# EAGLE schematic Trabalho_Esquematico (EAGLE 9.7.0)
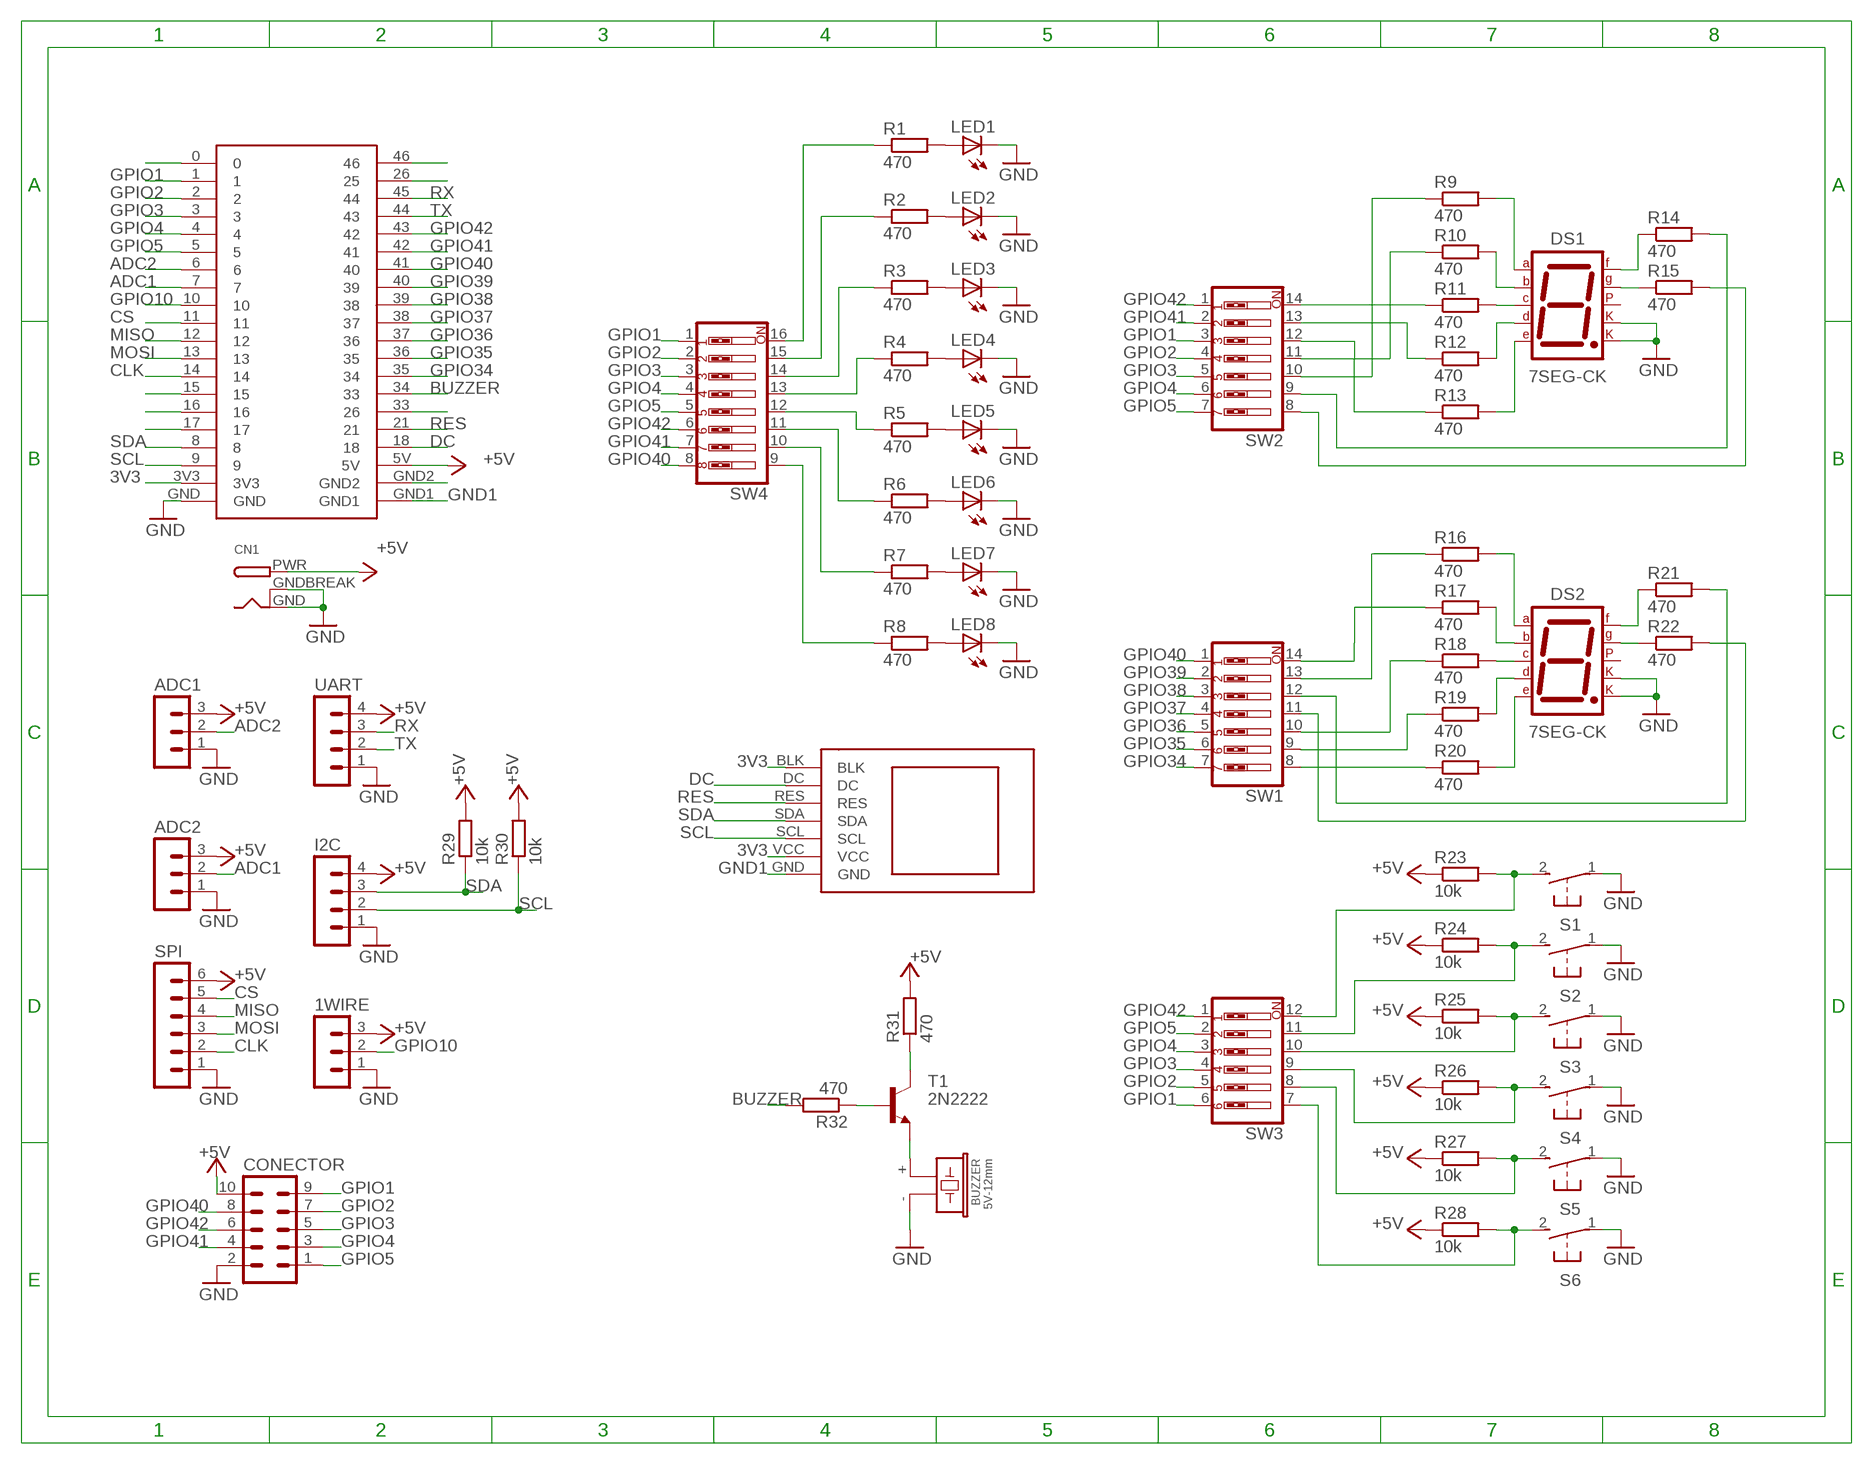
[diagram p0: schematic, sheet 1]

## Parts
1WIRE  MA03-1  [MA03-1]
ADC1  MA03-1  [MA03-1]
ADC2  MA03-1  [MA03-1]
BUZZER  5V-12mm  F/CM12P  [F/CM12P]
CN1  DCBARRELPTH  [DCJACK_2MM_PTH]
CONECTOR  MA05-2  [MA05-2]
DS1  7SEG-CK  [7SEG-13]
DS2  7SEG-CK  [7SEG-13]
I2C  MA04-1  [MA04-1]
LED1  LED5MM  [LED5MM]
LED2  LED5MM  [LED5MM]
LED3  LED5MM  [LED5MM]
LED4  LED5MM  [LED5MM]
LED5  LED5MM  [LED5MM]
LED6  LED5MM  [LED5MM]
LED7  LED5MM  [LED5MM]
LED8  LED5MM  [LED5MM]
R1  470  R-EU_0204/2V  [0204V]
R2  470  R-EU_0204/2V  [0204V]
R3  470  R-EU_0204/2V  [0204V]
R4  470  R-EU_0204/2V  [0204V]
R5  470  R-EU_0204/2V  [0204V]
R6  470  R-EU_0204/2V  [0204V]
R7  470  R-EU_0204/2V  [0204V]
R8  470  R-EU_0204/2V  [0204V]
R9  470  R-EU_0204/2V  [0204V]
R10  470  R-EU_0204/2V  [0204V]
R11  470  R-EU_0204/2V  [0204V]
R12  470  R-EU_0204/2V  [0204V]
R13  470  R-EU_0204/2V  [0204V]
R14  470  R-EU_0204/2V  [0204V]
R15  470  R-EU_0204/2V  [0204V]
R16  470  R-EU_0204/2V  [0204V]
R17  470  R-EU_0204/2V  [0204V]
R18  470  R-EU_0204/2V  [0204V]
R19  470  R-EU_0204/2V  [0204V]
R20  470  R-EU_0204/2V  [0204V]
R21  470  R-EU_0204/2V  [0204V]
R22  470  R-EU_0204/2V  [0204V]
R23  10k  R-EU_0204/2V  [0204V]
R24  10k  R-EU_0204/2V  [0204V]
R25  10k  R-EU_0204/2V  [0204V]
R26  10k  R-EU_0204/2V  [0204V]
R27  10k  R-EU_0204/2V  [0204V]
R28  10k  R-EU_0204/2V  [0204V]
R29  10k  R-EU_0204/7  [0204/7]
R30  10k  R-EU_0204/7  [0204/7]
R31  470  R-EU_0204/2V  [0204V]
R32  470  R-EU_0204/2V  [0204V]
S1  31-XX  [B3F-31XX]
S2  31-XX  [B3F-31XX]
S3  31-XX  [B3F-31XX]
S4  31-XX  [B3F-31XX]
S5  31-XX  [B3F-31XX]
S6  31-XX  [B3F-31XX]
SPI  MA06-1  [MA06-1]
SW1  SW_DIP-7  [EDG-07]
SW2  SW_DIP-7  [EDG-07]
SW3  SW_DIP-6  [EDG-06]
SW4  SW_DIP-8  [EDG-08]
T1  2N2222  [TO92-EBC-OVAL]
U$1  FRANZINHO  [ESP32-FRANZINHO]
U$2  IPS-LCD-1.3"  DISPLAY  [DISPLAY]
UART  MA04-1  [MA04-1]

## Nets
3V3: U$1.3V3 U$2.BLK U$2.VCC
+5V: 1WIRE.3 ADC1.3 ADC2.3 CN1.PWR CONECTOR.10 I2C.4 R23.1 R24.1 R25.1 R26.1 R27.1 R28.1 R29.2 R30.2 R31.2 SPI.6 U$1.5V UART.4
ADC1: ADC2.2 U$1.7
ADC2: ADC1.2 U$1.6
BUZZER: R32.2 U$1.34
CLK: SPI.2 U$1.14
CS: SPI.5 U$1.11
DC: U$1.18 U$2.DC
GND: 1WIRE.1 ADC1.1 ADC2.1 BUZZER.- CN1.GND CN1.GNDBREAK CONECTOR.2 DS1.3(CK1) DS1.8(CK2) DS2.3(CK1) DS2.8(CK2) I2C.1 LED1.K(C) LED2.K(C) LED3.K(C) LED4.K(C) LED5.K(C) LED6.K(C) LED7.K(C) LED8.K(C) S1.1(P) S2.1(P) S3.1(P) S4.1(P) S5.1(P) S6.1(P) SPI.1 U$1.GND UART.1
GND1: U$1.GND1 U$2.GND
GPIO1: CONECTOR.9 SW2.3 SW3.6 SW4.1 U$1.1
GPIO2: CONECTOR.7 SW2.4 SW3.5 SW4.2 U$1.2
GPIO3: CONECTOR.5 SW2.5 SW3.4 SW4.3 U$1.3
GPIO4: CONECTOR.3 SW2.6 SW3.3 SW4.4 U$1.4
GPIO5: CONECTOR.1 SW2.7 SW3.2 SW4.5 U$1.5
GPIO10: 1WIRE.2 U$1.10
GPIO34: SW1.7 U$1.35
GPIO35: SW1.6 U$1.36
GPIO36: SW1.5 U$1.37
GPIO37: SW1.4 U$1.38
GPIO38: SW1.3 U$1.39
GPIO39: SW1.2 U$1.40
GPIO40: CONECTOR.8 SW1.1 SW4.8 U$1.41
GPIO41: CONECTOR.4 SW2.2 SW4.7 U$1.42
GPIO42: CONECTOR.6 SW2.1 SW3.1 SW4.6 U$1.43
MISO: SPI.4 U$1.12
MOSI: SPI.3 U$1.13
N$1: BUZZER.+ T1.E
N$2: LED1.A R1.2
N$3: R31.1 T1.C
N$4: R32.1 T1.B
N$5: U$1.17
N$6: U$1.16
N$7: U$1.15
N$8: LED2.A R2.2
N$9: LED3.A R3.2
N$10: LED4.A R4.2
N$11: LED6.A R6.2
N$12: LED7.A R7.2
N$13: LED8.A R8.2
N$14: LED5.A R5.2
N$15: DS2.10(G) R22.1
N$16: DS2.9(F) R21.1
N$17: DS2.4(C) R18.2
N$18: DS2.2(D) R19.2
N$19: R13.1 SW2.12
N$20: U$1.0
N$22: U$1.GND2
N$23: R12.1 SW2.13
N$24: R11.1 SW2.14
N$25: R10.1 SW2.11
N$26: U$1.33
N$27: R9.1 SW2.10
N$28: R14.2 SW2.9
N$29: R15.2 SW2.8
N$30: R28.2 S6.2(S) SW3.7
N$31: R27.2 S5.2(S) SW3.8
N$32: R26.2 S4.2(S) SW3.9
N$33: R25.2 S3.2(S) SW3.10
N$34: R24.2 S2.2(S) SW3.11
N$35: R23.2 S1.2(S) SW3.12
N$36: R1.1 SW4.16
N$37: R8.1 SW4.9
N$38: R7.1 SW4.10
N$39: U$1.26
N$40: U$1.46
N$41: R2.1 SW4.15
N$42: R6.1 SW4.11
N$43: R3.1 SW4.14
N$44: R5.1 SW4.12
N$45: R4.1 SW4.13
N$46: DS2.1(E) R20.2
N$47: DS2.6(B) R17.2
N$48: DS2.7(A) R16.2
N$50: R19.1 SW1.9
N$51: R18.1 SW1.10
N$52: R17.1 SW1.14
N$53: R16.1 SW1.13
N$54: R21.2 SW1.12
N$55: R22.2 SW1.11
N$56: DS1.10(G) R15.1
N$57: DS1.9(F) R14.1
N$58: DS1.4(C) R11.2
N$59: DS1.2(D) R12.2
N$60: DS1.1(E) R13.2
N$61: DS1.6(B) R10.2
N$62: DS1.7(A) R9.2
N$63: R20.1 SW1.8
RES: U$1.21 U$2.RES
RX: U$1.45 UART.3
SCL: I2C.2 R30.1 U$1.9 U$2.SCL
SDA: I2C.3 R29.1 U$1.8 U$2.SDA
TX: U$1.44 UART.2
Unconnected: DS1.5(DP) DS2.5(DP)

## Library data of the parts
1WIRE ADC1 ADC2 = con-lstb:MA03-1: PIN HEADER; OC_FARNELL: unknown; OC_NEWARK: unknown
BUZZER = buzzer:F/CM12P: BUZZER Source: Buerklin; OC_FARNELL: unknown; OC_NEWARK: unknown
CN1 = adafruit:DCBARREL: 2.0mm DC Barrel Jack DCJACK_2MM_PTH - Through Hole Jack (4UConnector: 05537)
CONECTOR = con-lstb:MA05-2: PIN HEADER; OC_FARNELL: unknown; OC_NEWARK: unknown
DS1 DS2 = Opto-Electronic:7SEG-CK: 7-segment DISPLAY single cathode, 13 mm; CATEGORY: Opto-Electronic; SUB-CATEGORY: Display; TYPE: 7-Segment
I2C UART = con-lstb:MA04-1: PIN HEADER; OC_FARNELL: unknown; OC_NEWARK: unknown
LED1-LED8 = adafruit:LED: LED OSRAM: - CHIPLED LG R971, LG N971, LY N971, LG Q971, LY Q971, LO R971, LY R971 LH N974, LH R974 LS Q976, LO Q976, LY Q976 LO Q996 - Hyper CHIPLED LW Q18S LB Q993, LB Q99A, LB R99A - SideLED LS A670, LO A670, LY A670, LG A670, LP A670 LB A673, LV A673, LT A673, LW A673 LH A674 LY A675 LS A676, LA A676, LO A676, LY A676, LW A676 LS A679, LY A679, LG A679 - Hyper Micro SIDELED® LS Y876, LA Y876, LO Y876, LY Y876 LT Y87S - SmartLED LW L88C, LW L88S LB L89C, LB L89S, LG L890 LS L89K, LO L89K, LY L89K LS L896, LA L896, LO L896, LY L896 - TOPLED LS T670, LO T670, LY T670, LG T670, LP T670 LSG T670, LSP T670, LSY T670, LOP T670, LYG T670 LG T671, LOG T671, LSG T671 LB T673, LV T673, LT T673, LW T673 LH T674 LS T676, LA T676, LO T676, LY T676, LB T676, LH T676, LSB T676, LW T676 LB T67C, LV T67C, LT T67C, LS T67K, LO T67K, LY T67K, LW E67C LS E67B, LA E67B, LO E67B, LY E67B, LB E67C, LV E67C, LT E67C LW T67C LS T679, LY T679, LG T679 LS T770, LO T770, LY T770, LG T770, LP T770 LB T773, LV T773, LT T773, LW T773 LH T774 LS E675, LA E675, LY E675, LS T675 LS T776, LA T776, LO T776, LY T776, LB T776 LHGB T686 LT T68C, LB T68C - Hyper Mini TOPLED® LB M676 - Mini TOPLED Santana® LG M470 LS M47K, LO M47K, LY M47K Source: http://www.osram.convergy.de/
R1-R32 = rcl:R-EU_: RESISTOR, European symbol; SPICEPREFIX: R
S1-S6 = adafruit:31-XX: OMRON SWITCH Now with beefier pads!
SPI = con-lstb:MA06-1: PIN HEADER; OC_FARNELL: unknown; OC_NEWARK: unknown
SW1 SW2 = special:SW_DIP-7: DIP SWITCH
SW3 = special:SW_DIP-6: DIP SWITCH
SW4 = special:SW_DIP-8: DIP SWITCH
T1 = adafruit:2N2222: NPN TRANSISTOR Big oval pads
U$1 = Esp 32:FRANZINHO
U$2 = dISPLAY:DISPLAY